# Altium project InhalerCapPCB.PrjPcb
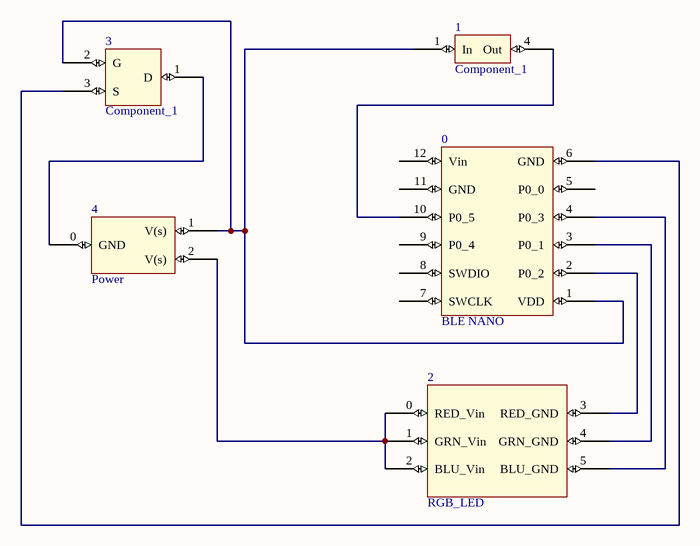
[diagram p0: InhalerCap.SchDoc]
1 sheet, 5 parts. Net scope: global (net labels, ports and power ports of the same name join across sheets).
Board file: InhalerCap.PcbDoc

## Sheet InhalerCap.SchDoc
size A

### Parts
0  BLE NANO  [BLE_NANO]
1  Component_1  [Button]
2  RGB_LED  [BIG_LED]
3  Component_1  [MOSFET_3_PIN]
4  Power  [CR2032_Holder]

### Nets
Net0_1: 0.1(VDD) 1.1(In) 3.2(G) 4.1(V(s))
Net0_2: 0.2(P0_2) 2.3(RED_GND)
Net0_3: 0.3(P0_1) 2.4(GRN_GND)
Net0_4: 0.4(P0_3) 2.5(BLU_GND)
Net0_6: 0.6(GND) 3.3(S)
Net0_10: 0.10(P0_5) 1.4(Out)
Net2_0: 2.0(RED_Vin) 2.1(GRN_Vin) 2.2(BLU_Vin) 4.2(V(s))
Net3_1: 3.1(D) 4.0(GND)

Not connected (* = marked no-connect by the designer): 0 5(P0_0) 7(SWCLK) 8(SWDIO) 9(P0_4) 11(GND) 12(Vin)

### Library data of the parts
4 = Coin_Cell_Battery_Holder